# Altium schematic sheet 3v3_Buck.SchDoc
size A; SheetNumber: 3; SheetTotal: 6
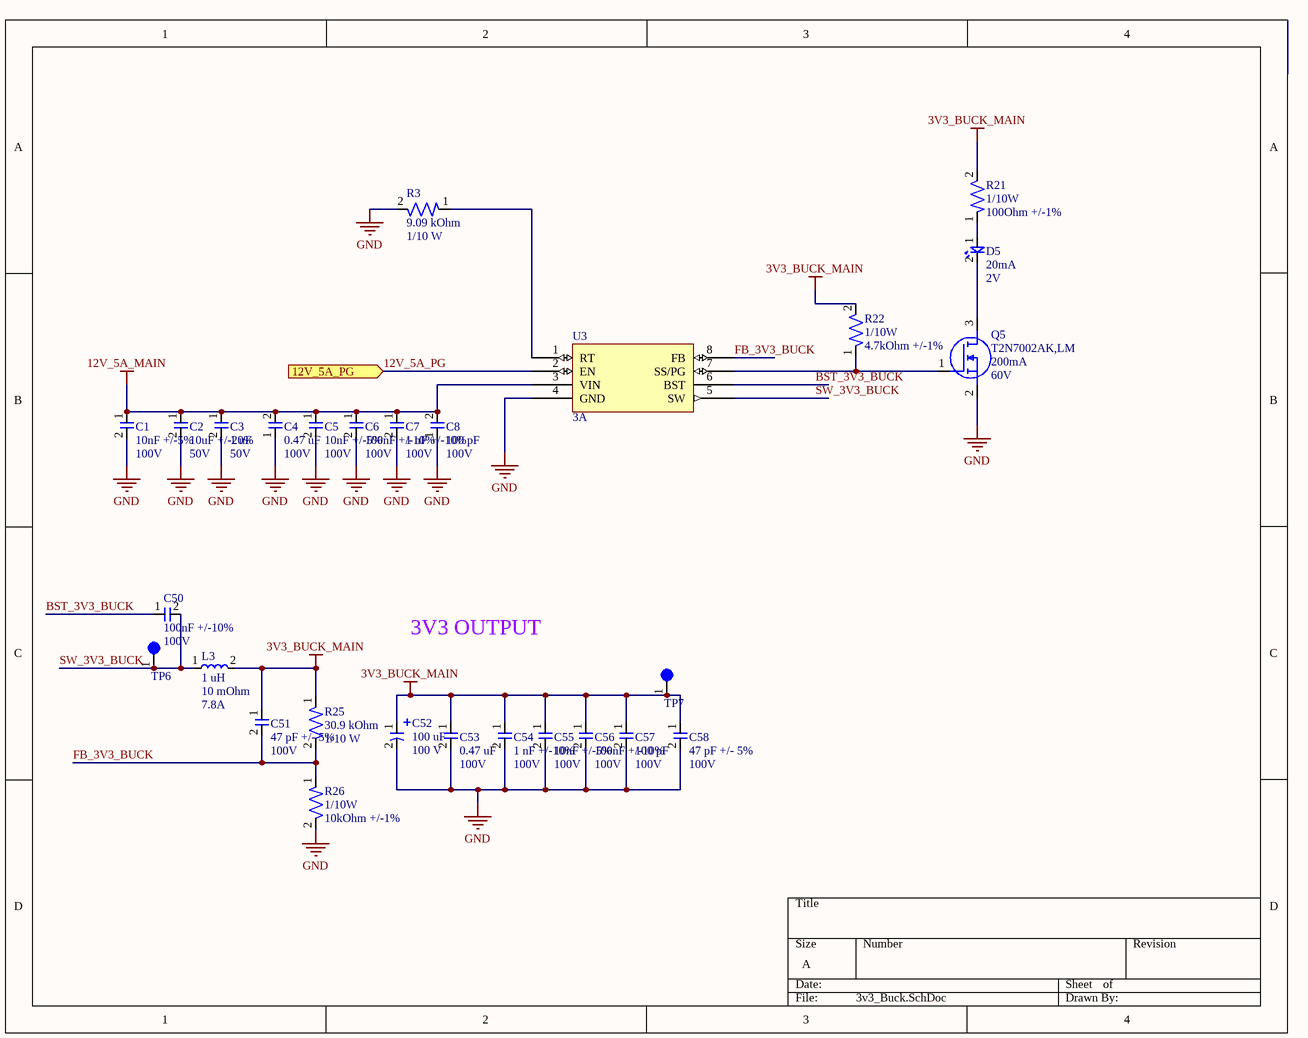
[diagram p0: 3v3_Buck.SchDoc]

## Parts
C1  Capacitance: 10nF +/-5%  Voltage Rating: 100V  [CAP-0603]  (hidden comment: C1608C0G2A103J080AC)
C2  Capacitance: 10uF +/-20%  Voltage Rating: 50V  [CAP-1206]  (hidden comment: CL31B106KBHNNNE)
C3  Capacitance: 1 uF  Voltage: 50V  [CAP-0603]  (hidden comment: UMK107AB7105KA-T)
C4  Capacitance: 0.47 uF  Voltage: 100V  [CAP-0805]  (hidden comment: KAM21KR72A474KL)
C5  Capacitance: 10nF +/-5%  Voltage Rating: 100V  [CAP-0603]  (hidden comment: C1608C0G2A103J080AC)
C6  Capacitance: 100nF +/-10%  Voltage Rating: 100V  [CAP-0603]  (hidden comment: CC0603KRX7R0BB104)
C7  Capacitance: 1 nF +/-10%  Voltage: 100V  [CAP-0603]  (hidden comment: C0603Y102K1RAC7867)
C8  Capacitance: 100 pF  Voltage: 100V  [CAP-0603]  (hidden comment: 0603N101J101CT)
C50  Capacitance: 100nF +/-10%  Voltage Rating: 100V  [CAP-0603]  (hidden comment: CC0603KRX7R0BB104)
C51  Capacitance: 47 pF +/- 5%  Voltage Rating: 100V  [CAP-0603]  (hidden comment: 7447798111)
C52  Capacitance: 100 uF  Voltage: 100 V  [ELEC-100U-0001]  (hidden comment: 100SEV100M12.5X16)
C53  Capacitance: 0.47 uF  Voltage: 100V  [CAP-0805]  (hidden comment: KAM21KR72A474KL)
C54  Capacitance: 1 nF +/-10%  Voltage: 100V  [CAP-0603]  (hidden comment: C0603Y102K1RAC7867)
C55  Capacitance: 10nF +/-5%  Voltage Rating: 100V  [CAP-0603]  (hidden comment: C1608C0G2A103J080AC)
C56  Capacitance: 100nF +/-10%  Voltage Rating: 100V  [CAP-0603]  (hidden comment: CC0603KRX7R0BB104)
C57  Capacitance: 100 pF  Voltage: 100V  [CAP-0603]  (hidden comment: 0603N101J101CT)
C58  Capacitance: 47 pF +/- 5%  Voltage Rating: 100V  [CAP-0603]  (hidden comment: 7447798111)
D5  Current Rating: 20mA  Vf: 2V  [LED-0603]  (hidden comment: 150060AS75000)
L3  Inductance: 1 uH  DCR: 10 mOhm  DCI: 7.8A  [PWRIND-6.8U-0001]  (hidden comment: SRN8040-1R0Y)
Q5  T2N7002AK,LM  Id-Continuous: 200mA  VDS-Max: 60V  [NMOS-SOT23-3]
R3  Resistance: 9.09 kOhm  Power: 1/10 W  [RES-0603]  (hidden comment: RC0603FR-079K09L)
R21  Power Rating: 1/10W  Resistance: 100Ohm +/-1%  [RES-0603]  (hidden comment: AC0603FR-10100RL)
R22  Power Rating: 1/10W  Resistance: 4.7kOhm +/-1%  [RES-0603]  (hidden comment: AF0603FR-074K7L)
R25  Resistance: 30.9 kOhm  Power: 1/10 W  [RES-0603]  (hidden comment: RC0603FR-0730K9L)
R26  Power Rating: 1/10W  Resistance: 10kOhm +/-1%  [RES-0603]  (hidden comment: RC0603FR-0710KP)
TP6  5003  [TEST-POINT-0001]  (value not drawn)
TP7  5003  [TEST-POINT-0001]  (value not drawn)
U3  Current: 3A  [IC-SOT583]  (hidden comment: TPS62933ODRLR)

## Ports
12V_5A_PG (in, see 5V_Buck[3B], 12V_Buck[4B])

## Nets
3V3_BUCK_MAIN: C51.1 C52.1 C53.1 C54.1 C55.1 C56.1 C57.1 C58.1 L3.2 R21.2 R22.2 R25.1 TP7.1
12V_5A_MAIN: C1.1 C2.1 C3.1 C4.2 C5.1 C6.1 C7.1 C8.2 U3.3(VIN)
GND: C1.2 C2.2 C3.2 C4.1 C5.2 C6.2 C7.2 C8.1 C52.2 C53.2 C54.2 C55.2 C56.2 C57.2 C58.2 Q5.2(S) R3.2 R26.2 U3.4(GND)
12V_5A_PG: U3.2(EN) ; port 12V_5A_PG
BST_3V3_BUCK: C50.1 U3.6(BST)
FB_3V3_BUCK: C51.2 R25.2 R26.1 U3.8(FB)
SW_3V3_BUCK: C50.2 L3.1 TP6.1 U3.5(SW)
NetD5_1: D5.1 R21.1
NetD5_2: D5.2 Q5.3(D)
NetQ5_1: Q5.1(G) R22.1 U3.7(SS/PG)
NetR3_1: R3.1 U3.1(RT)

## Notes on the sheet
- 3V3 OUTPUT

## Library data of the parts
C1 C5 C55 = CAP-10N-0002: CAP CER 10000PF 100V C0G 0603; Manufacturer: TDK Corporation; Temperature Coefficient: C0G/NP0; Assembled?: no; Manufacturer Part Number: C1608C0G2A103J080AC; Package Size: 0603
C2 = CAP-10U-0001: 10 µF ±10% 50V Ceramic Capacitor X7R 1206 (3216 Metric); Manufacturer: Samsung Electro-Mechanics; Assembled?: no; Manufacturer Part Number: CL31B106KBHNNNE; Temperature Coefficient: X7R; Package Size: 1206
C3 = CAP-1U-0002: 1 µF ±10% 50V Ceramic Capacitor X7R 0603 (1608 Metric); Package Size: 0603
C4 C53 = CAP-0.47U-0001: 0.47 µF ±10% 100V Ceramic Capacitor X7R 0805 (2012 Metric); Tolerance: +/- 10%; Assembled?: No; Temperature Coefficient: X7R; Package Size: 0805
C6 C50 C56 = CAP-100N-0001: CAP CER 0.1UF 100V X7R 0603; Manufacturer: YAGEO; Assembled?: no; Manufacturer Part Number: CC0603KRX7R0BB104; Temperature Coefficient: X7R; Package Size: 0603
C7 C54 = CAP-1N-0001: 1000 pF ±10% 100V Ceramic Capacitor X7R 0603 (1608 Metric)
C8 C57 = CAP-100P-0002: 100 pF ±5% 100V Ceramic Capacitor C0G, NP0 0603 (1608 Metric); Tolerance: +/-5%; Temp Coeff: C0G/NP0; Package Size: 0603
C51 C58 = CAP-47P-0001: 47 pF ±5% 100V Ceramic Capacitor C0G, NP0 0603 (1608 Metric)
C52 = ELEC-100U-0001: 100 µF 100 V Aluminum Electrolytic Capacitors Radial, Can - SMD 2000 Hrs @ 85°C; Manufacturer: Rubycon; Tolerance: +/- 20%; Assembled?: No; ESR: idk check the datasheet i couldnt find it
D5 = LED_Amber_0001: CAP CER 0.1UF 100V X7R 0603; Manufacturer: Wurth Electronik; Assembled?: no; Color: Amber; Manufacturer Part Number: 150060AS75000; Package Size: 0603
L3 = PWRIND-1U-0001: 1 µH Semi-Shielded Drum Core, Wirewound Inductor 7.8 A 10mOhm Max Nonstandard; Isat: 11A; Tolerance: 30%; Assembled?: No
Q5 = NMOS-200MA-0001: MOSFET N-CH 60V 200MA SOT23; Manufacturer: Toshiba; FET type: N-Channel; Rds On-Max: 3.9Ohm; Vgs-Max: 20V; Assembled?: no; Manufacturer Part Number: T2N7002AK,LM; Package: SOT-23-3
R3 = RES-9.09K-0001: 9.09 kOhms ±1% 0.1W, 1/10W Chip Resistor 0603 (1608 Metric) Moisture Resistant Thick Film; Tolerance: +/-1%; Assembled?: No; Package Size: 0603
R21 = RES-100-0002: 100 Ohms ±1% 0.1W, 1/10W Chip Resistor 0603 (1608 Metric) Automotive AEC-Q200 Thick Film; Manufacturer: YAGEO; Assembled?: no; Manufacturer Part Number: AC0603FR-10100RL; Package Size: 0603
R22 = RES-4.7K-0002: RES SMD 4.7K OHM 1% 1/10W 0603; Manufacturer: YAGEO; Assembled?: no; Manufacturer Part Number: AF0603FR-074K7L; Package Size: 0603
R25 = RES-30.9K-0001: 30.9 kOhms ±1% 0.1W, 1/10W Chip Resistor 0603 (1608 Metric) Moisture Resistant Thick Film; Assembled?: No; Tolerance: 1%; Package Size: 0603
R26 = RES-10K-0002: RES SMD 10K OHM 1% 1/10W 0603; Manufacturer: YAGEO; Assembled?: no; Manufacturer Part Number: RC0603FR-0710KP; Package Size: 0603
TP6 TP7 = TEST-POINT-0001: Oranange PC Test Point, Miniature Phoisphor Bronze Silver Plating Through Hole Mounting Type
U3 = IC-BUCK-0010: Buck Switching Regulator IC Positive Adjustable 0.8V 1 Output 3A SOT-583; Manufacturer: Texas Instruments; Assembled?: no; Manufacturer Part Number: TPS62933ODRLR; Type: Buck